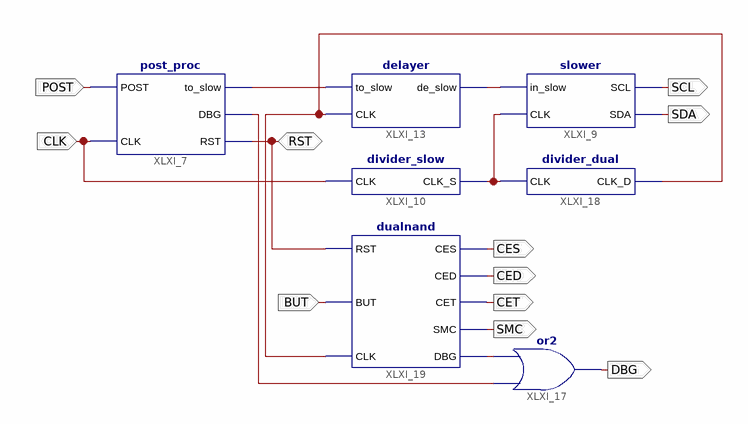
[diagram p0: schematic sheet 1]
// Xilinx ISE schematic overall.sch (xbr) as structural Verilog: 7 symbols, 11 ports
module overall (
  input  POST,
  input  CLK,
  input  BUT,
  inout  RST,
  output SDA,
  output SCL,
  output CED,
  output CES,
  output DBG,
  output SMC,
  output CET
);

  wire XLXN_70, XLXN_76, XLXN_130, XLXN_139, XLXN_188, XLXN_189;

  post_proc XLXI_7 (.POST(POST), .CLK(CLK), .RST(RST), .to_slow(XLXN_70), .DBG(XLXN_139));
  delayer XLXI_13 (.to_slow(XLXN_70), .CLK(XLXN_188), .de_slow(XLXN_76));
  slower XLXI_9 (.SCL(SCL), .SDA(SDA), .in_slow(XLXN_76), .CLK(XLXN_189));
  divider_slow XLXI_10 (.CLK(CLK), .CLK_S(XLXN_189));
  divider_dual XLXI_18 (.CLK(XLXN_189), .CLK_D(XLXN_188));
  or XLXI_17 (DBG, XLXN_139, XLXN_130);
  dualnand XLXI_19 (.RST(RST), .CES(CES), .CED(CED), .DBG(XLXN_130), .SMC(SMC), .CET(CET), .CLK(XLXN_188), .BUT(BUT));
endmodule
